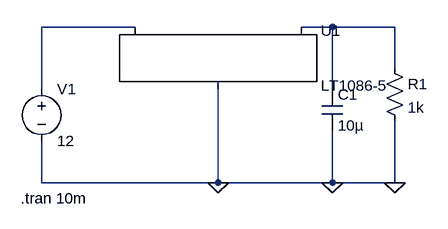
[diagram p0: schematic 5V-Power-Supply.asc]
5V-Power-Supply.asc, the LTspice schematic file:
Version 4.1
SHEET 1 880 680
WIRE 48 -160 -96 -160
WIRE 352 -160 304 -160
WIRE 448 -160 352 -160
WIRE 448 -96 448 -160
WIRE -96 -64 -96 -160
WIRE 352 -64 352 -160
WIRE -96 80 -96 16
WIRE 176 80 176 -64
WIRE 176 80 -96 80
WIRE 352 80 352 0
WIRE 352 80 176 80
WIRE 448 80 448 -16
WIRE 448 80 352 80
FLAG 352 80 0
FLAG 176 80 0
FLAG 448 80 0
SYMBOL voltage -96 -80 R0
WINDOW 123 0 0 Left 0
WINDOW 39 0 0 Left 0
SYMATTR InstName V1
SYMATTR Value 12
SYMBOL PowerProducts\\LT1086-5 176 -160 R0
SYMATTR InstName U1
SYMBOL res 432 -112 R0
SYMATTR InstName R1
SYMATTR Value 1k
SYMBOL cap 336 -64 R0
SYMATTR InstName C1
SYMATTR Value 10µ
TEXT -128 104 Left 2 !.tran 10m

The netlist it stands for:
* 5V-Power-Supply.asc
V1 N001 0 12
X§U1 0 N002 N001 LT1086-5
R1 N002 0 1k
C1 N002 0 10µ
.tran 10m
.backanno
.end